# Altium schematic sheet Power.SchDoc
size A; SheetNumber: 3; SheetTotal: 4
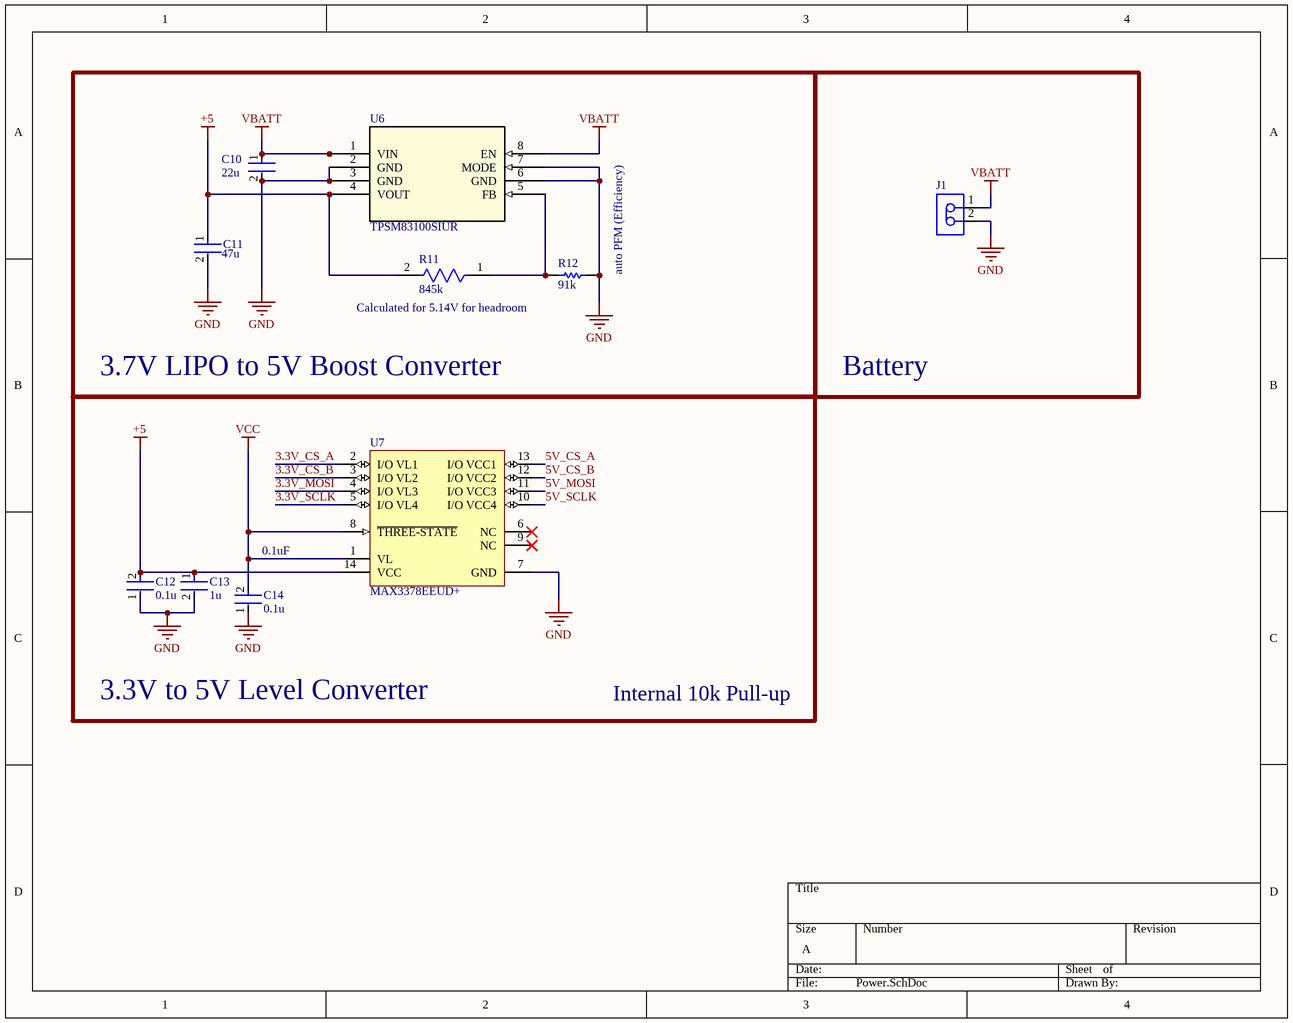
[diagram p0: Power.SchDoc]

## Parts
C10  22u  [FP-GRM187-0_2-IPC_C]
C11  47u  [FP-GRM219-0_2-0_1-IPC_A]
C12  0.1u  [FP-GCJ188-0_2-IPC_C]
C13  1u  [FP-GCM188-0_1-IPC_B]
C14  0.1u  [FP-GCJ188-0_2-IPC_C]
J1  B2B-PH-K-S(LF)(SN)  [JST-B2B-PH-K-S_V]  (value not drawn)
R11  845k  [FP-CR0603-IPC_B]
R12  91k  [RESC1609X50X30NL10T20]
U6  TPSM83100SIUR  [MICROSIP8_SIU_TEX]
U7  MAX3378EEUD+  [MAXM-U14+1_V]

## Blocks framed on the sheet
3.7V LIPO to 5V Boost Converter: C10 C11 R11 R12 U6
Battery: J1
3.3V to 5V Level Converter: C12-C14 U7

## Nets
+5: C11.1 C12.2 C13.1 R11.2 U6.4(VOUT) U7.14(VCC)
GND: C10.2 C11.2 C12.1 C13.2 C14.1 J1.2 R12.1 U6.2(GND) U6.3(GND) U6.6(GND) U6.7(MODE) U7.7(GND)
VBATT: C10.1 J1.1 U6.1(VIN) U6.8(EN)
VCC: C14.2 U7.1(VL) U7.8(~{THREE-STATE})
3.3V_CS_A: U7.2(I/O_VL1)
3.3V_CS_B: U7.3(I/O_VL2)
3.3V_MOSI: U7.4(I/O_VL3)
3.3V_SCLK: U7.5(I/O_VL4)
5V_CS_A: U7.13(I/O_VCC1)
5V_CS_B: U7.12(I/O_VCC2)
5V_MOSI: U7.11(I/O_VCC3)
5V_SCLK: U7.10(I/O_VCC4)
NetR11_1: R11.1 R12.2 U6.5(FB)

Not connected (* = marked no-connect by the designer): U7 6(NC)* 9(NC)*

## Notes on the sheet
- (near R12) auto PFM (Efficiency)
- Calculated for 5.14V for headroom
- (near C14) 0.1uF
- Internal 10k Pull-up

## Library data of the parts
C10 = CMP-06035-049226-1: Chip Multilayer Ceramic Capacitors for General Purpose, 0603, 22uF, X5R, 15%, 20%, 10V; Dielectric: X5R; Capacitance: 22uF; Voltage Rating: 10V; Case/Package: 0603; Case Code (Imperial): 0603; Voltage Rating (DC): 10V; Mount: Surface Mount; Length: 0.063inch; Width: 0.031inch; Max Operating Temperature: 85°C; Thickness: 0.031inch; Tolerance: 20%; Case Code (Metric): 1608; Packaging: Tape and Reel; Min Operating Temperature: -55°C
C11 = CMP-06035-004086-1: Chip Multilayer Ceramic Capacitors for General Purpose, 0805, 47uF, X5R, 15%, 20%, 6.3V; Case Code (Metric): 2012; Voltage Rating: 6.3V; Case Code (Imperial): 0805; Max Operating Temperature: 85°C; Width: 0.049inch; Length: 0.079inch; Min Operating Temperature: -55°C; Mount: Surface Mount; Packaging: Tape and Reel; Case/Package: 0805; Thickness: 0.037inch; Capacitance: 47uF; Tolerance: 20%
C12 C14 = CMP-2006-02223-2: Cap Ceramic 0.1uF 50V X7R 10% Pad SMD 0603 Soft Termination +125°C Automotive T/R; Capacitance: 100nF; Radiation Hardening: No; Dielectric: X7R; Voltage Rating (DC): 50V; Case Code (Imperial): 0603; Length: 1.6mm; Features: Soft Termination; Case Code (Metric): 1608; Case/Package: 0603; Termination: SMD/SMT; Packaging: Tape and Reel; Height: 0.8mm; Tolerance: 10%; Thickness: 0.035inch; Width: 0.031inch; Voltage Rating: 50V; Min Operating Temperature: -55°C; Ratings: AEC-Q200; Package Quantity: 1; Depth: 0.8mm; Mount: Surface Mount; Lead Free: Lead Free; Max Operating Temperature: 125°C
C13 = CMP-2006-02357-2: Ceramic Capacitor for Automotive 1uF  ±10% 16VDC X7R 0603 Paper T/R; Voltage: 16V; Thickness: 0.035inch; Width: 0.031inch; Radiation Hardening: No; Depth: 0.8mm; Max Operating Temperature: 125°C; Package Quantity: 1; Ratings: AEC-Q200; Min Operating Temperature: -55°C; Packaging: Tape and Reel; Case Code (Metric): 1608; REACH SVHC: No SVHC; Dielectric: X7R; Case Code (Imperial): 0603; Length: 1.6mm; Height: 0.8mm; Voltage Rating: 16V; Termination: SMD/SMT; Case/Package: 0603; Voltage Rating (DC): 16V; Tolerance: 10%; Capacitance: 1uF; Mount: Surface Mount; Lead Free: Lead Free
J1 = CMP-2000-05162-1: Male Header, Pitch 2 mm, 1 x 2 Position, Height 6 mm, Tail Length 3.4 mm, -25 to 85 degC, RoHS, Bulk; Manufacturer: JST; Pitch: 2mm; Style/Orientation: StraightHeader/Plug; No of Positions: 2; Datasheet Version: Nov-08; Datasheet URL: http://datasheet.octopart.com/B2B-PH-K-S%28LF%29%28SN%29-JST-datasheet-8324864.pdf; Manufacturer URL: http://www.jst.com/home2.html; Type: ShroudedHeader; Termination: Crimp
R11 = CMP-07231-001938-1: Thick Film Chip Resistors 0603 845kΩ 0.1W 1% 100ppm/°C; Voltage Rating: 50V; Power Rating: 100mW; Resistance: 845kR; Contact Plating: Tin; Case/Package: 0603; Tolerance: 1%; Case Code (Metric): 1608; Termination: SMD/SMT; Min Operating Temperature: -55°C; Depth: 0.8mm; Mount: Surface Mount; Max Operating Temperature: 155°C; Thickness: 457um; Military Standard: Not; Height: 0.45mm; Radiation Hardening: No; Length: 1.6mm; Temperature Coefficient: 100ppm/°C; Case Code (Imperial): 0603; Package Quantity: 5000; Width: 0.8mm; Composition: Thick Film; Packaging: Tape and Reel
R12 = CMP-2000-03640-1: Part Number: CRCW060391K0FKEA; Manufacturer: Vishay Dale
U6 = TPSM83100SIUR: 1.5-A high efficiency buck-boost module with integrated inductor; Mfr_Name: Texas Instruments; Type: Power Management; RefDes: RefDes; Supplier 1: Mouser; Supplier Part Number 1: 595-TPSM83100SIUR
U7 = CMP-1703-00001-3: +/-15 kV ESD-Protected, 1 uA, 8 Mbps, Quad Low-Voltage Level Translator in UCSP, 1.65 to 5.5 V, -40 to 85 degC, 14-Pin TSSOP (U14+1), RoHS, Tube; Channels: 4; Min Supply Voltage: 1.65 V; Max Supply Voltage: 5.5 V; Max Ouput Current: -20 uA; Output Current: 1 mA; Case/Package: TSSOP; DatasheetVersion: Rev. 3; Inputs: 4; Max Operating Temperature: 85 degC; ComponentLink3URL: http://pdfserv.maximintegrated.com/package_dwgs/21-0066.PDF; Mount: Surface Mount; Weight: 0.004949 oz; Code_JEDEC: MO-153; ComponentLink3Description: Package Specification; Packaging: Rail/Tube; Pins: 14; REACH SVHC: No SVHC; Package Quantity: 96; PartNumber: MAX3378EEUD+; Width: 4.5 mm; ComponentLink1Description: Manufacturer URL; Height: 0.95 mm; ComponentLink2URL: https://datasheets.maximintegrated.com/en/ds/MAX3372E-MAX3393E.pdf; Radiation Hardening: No; Length: 5.1 mm; PackageDescription: 14-Pin Thin Shrink Small-Outline Package (U14+1), Body 5 x 4.4 mm, Pitch 0.65 mm; RoHSCompliant: True; Min Operating Temperature: -40 degC; Mounting Technology: Surface Mount; ComponentLink2Description: Datasheet; ComponentLink1URL: http://www.maximintegrated.com/